# EAGLE design dvere (EAGLE 5.12)
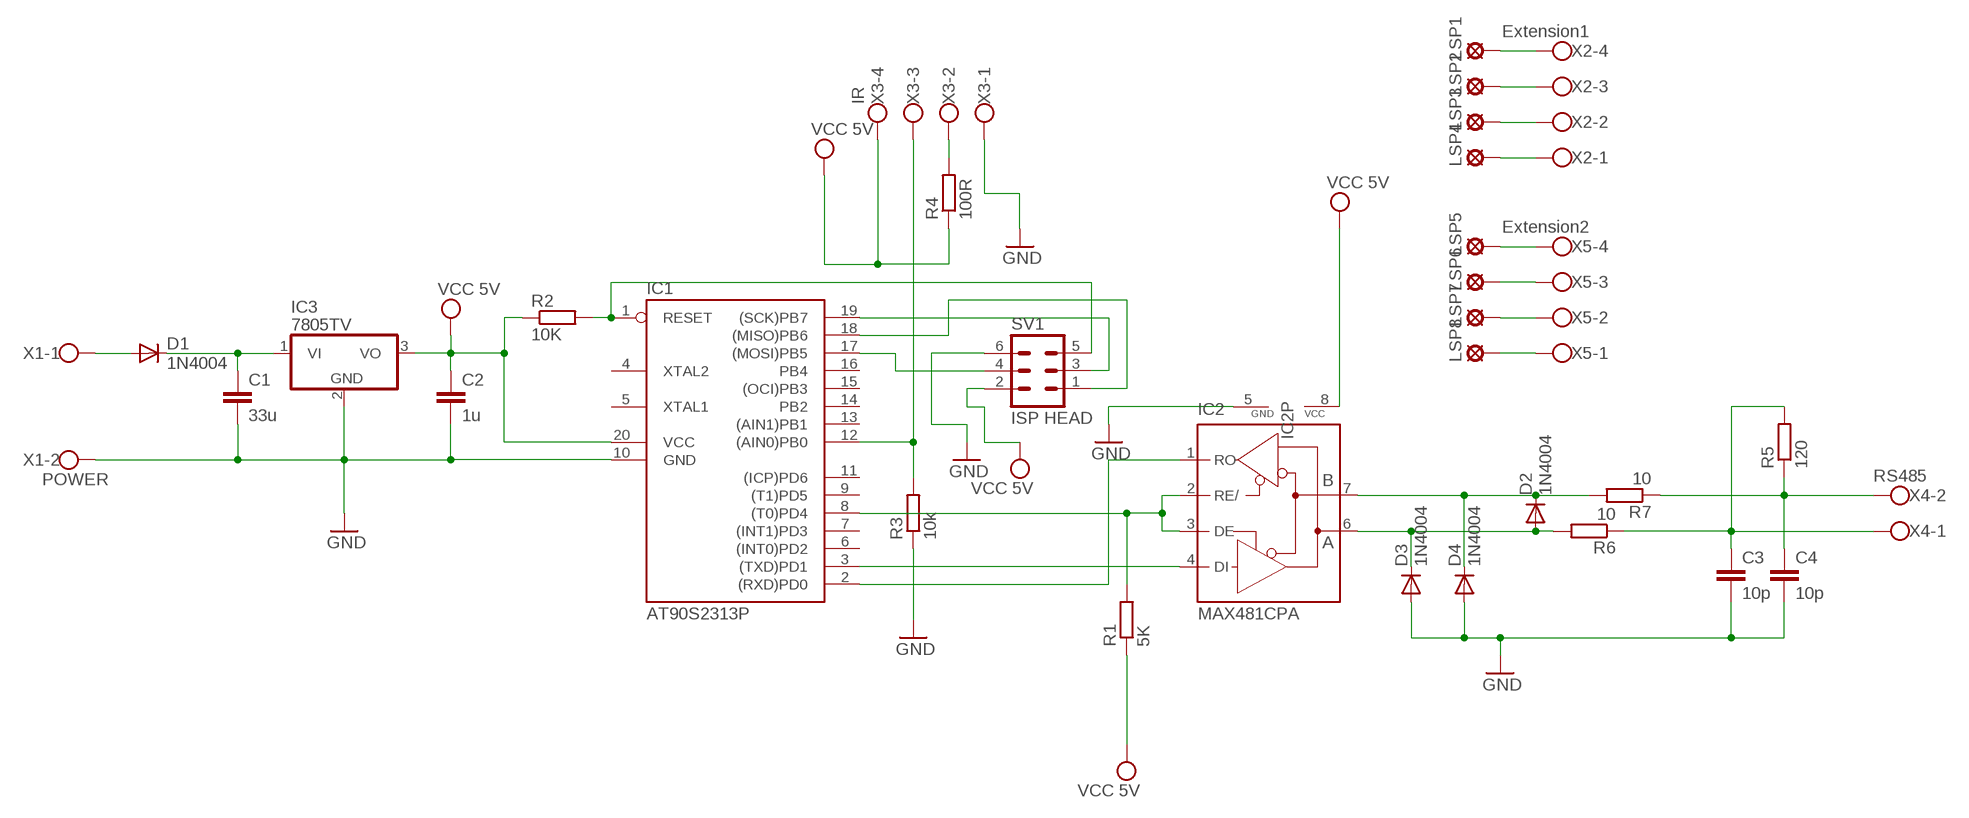
[diagram p0: schematic, sheet 1]

## Parts
C1  33u  C-EU025-025X050  [C025-025X050]
C2  1u  C-EU025-025X050  [C025-025X050]
C3  10p  C-EU025-025X050  [C025-025X050]
C4  10p  C-EU025-025X050  [C025-025X050]
D1  1N4004  [DO41-10]
D2  1N4004  [DO41-10]
D3  1N4004  [DO41-10]
D4  1N4004  [DO41-10]
IC1  AT90S2313P  [DIL20]
IC2  MAX481CPA  [DIL08]
IC3  7805TV  [TO220V]
LSP1  SE11  [SE11]
LSP2  SE11  [SE11]
LSP3  SE11  [SE11]
LSP4  SE11  [SE11]
LSP5  SE11  [SE11]
LSP6  SE11  [SE11]
LSP7  SE11  [SE11]
LSP8  SE11  [SE11]
R1  5K  R-EU_0207/10  [0207/10]
R2  10K  R-EU_0207/10  [0207/10]
R3  10k  R-EU_0207/10  [0207/10]
R4  100R  R-EU_0207/10  [0207/10]
R5  120  R-EU_0207/10  [0207/10]
R6  10  R-EU_0207/10  [0207/10]
R7  10  R-EU_0207/10  [0207/10]
SV1  ISP HEAD  ML6  [ML6]
X1  POWER  W237-102  [W237-102]
X2  Extension1  W237-4  [W237-4]
X3  IR  W237-4  [W237-4]
X4  RS485  W237-102  [W237-102]
X5  Extension2  W237-4  [W237-4]

## Nets
GND: C1.2 C2.2 C3.2 C4.2 D3.A D4.A IC1.10(GND) IC2.5(GND) IC3.2(GND) R3.1 SV1.6 X1.2 X3.1
N$1: IC1.17((MOSI)PB5) SV1.4
N$2: IC1.2((RXD)PD0) IC2.1(RO)
N$3: IC1.3((TXD)PD1) IC2.4(DI)
N$4: IC1.8((T0)PD4) IC2.2(RE/) IC2.3(DE) R1.2
N$5: IC1.19((SCK)PB7) SV1.3
N$6: IC1.18((MISO)PB6) SV1.1
N$7: IC1.1(RESET) R2.2 SV1.5
N$8: D1.A X1.1
N$9: C3.1 R5.2 R6.1 X4.1
N$10: D2.C D4.C IC2.7(B) R7.2
N$11: IC1.12((AIN0)PB0) R3.2 X3.3
N$12: R4.2 X3.2
N$13: C1.1 D1.C IC3.1(VI)
N$14: LSP1.MP X2.4
N$15: LSP2.MP X2.3
N$16: LSP3.MP X2.2
N$17: LSP4.MP X2.1
N$18: LSP5.MP X5.4
N$19: LSP6.MP X5.3
N$20: LSP7.MP X5.2
N$21: LSP8.MP X5.1
N$22: C4.1 R5.1 R7.1 X4.2
N$23: D2.A D3.C IC2.6(A) R6.2
VCC: C2.1 IC1.20(VCC) IC2.8(VCC) IC3.3(VO) R1.1 R2.1 R4.1 SV1.2 X3.4 ; supply symbol labelled VCC 5V
Unconnected: IC1.4(XTAL2) IC1.5(XTAL1) IC1.6((INT0)PD2) IC1.7((INT1)PD3) IC1.9((T1)PD5) IC1.11((ICP)PD6) IC1.13((AIN1)PB1) IC1.14(PB2) IC1.15((OCI)PB3) IC1.16(PB4)

## Library data of the parts
C1-C4 = rcl:C-EU: CAPACITOR, European symbol
D1-D4 = diode:1N4004: DIODE general purpose rectifier, 1 A
IC1 = atmel:AT90S2313: MICROCONTROLLER 2 Kbytes FLASH 128 bytes SRAM 128 bytes EEPROM UART; OC_FARNELL: unknown; OC_NEWARK: unknown
IC2 = maxim:MAX481CPA: RS485 TRANSEIVER; MPN: MAX481CPA+; OC_FARNELL: unknown; OC_NEWARK: 99K3445
IC3 = linear:78*: Positive VOLTAGE REGULATOR Source: http://cache.national.com/ds/LM/LM78L05.pdf http://www.fairchildsemi.com/ds/LM/LM7805.pdf
LSP1-LSP8 = solpad:SE11: SOLDER PAD RTM, drill 1,1mm, distributor Buerklin, 07F810
R1-R7 = rcl:R-EU_: RESISTOR, European symbol
SV1 = con-harting-ml:ML6: HARTING; OC_FARNELL: unknown; OC_NEWARK: unknown
X1 X4 = con-wago-500:W237-102: WAGO SCREW CLAMP; MPN: 237-102; OC_FARNELL: unknown; OC_NEWARK: 70K9898
X2 X3 X5 = con-wago-500:W237-4: WAGO SCREW CLAMP; OC_FARNELL: unknown; OC_NEWARK: unknown

## Board
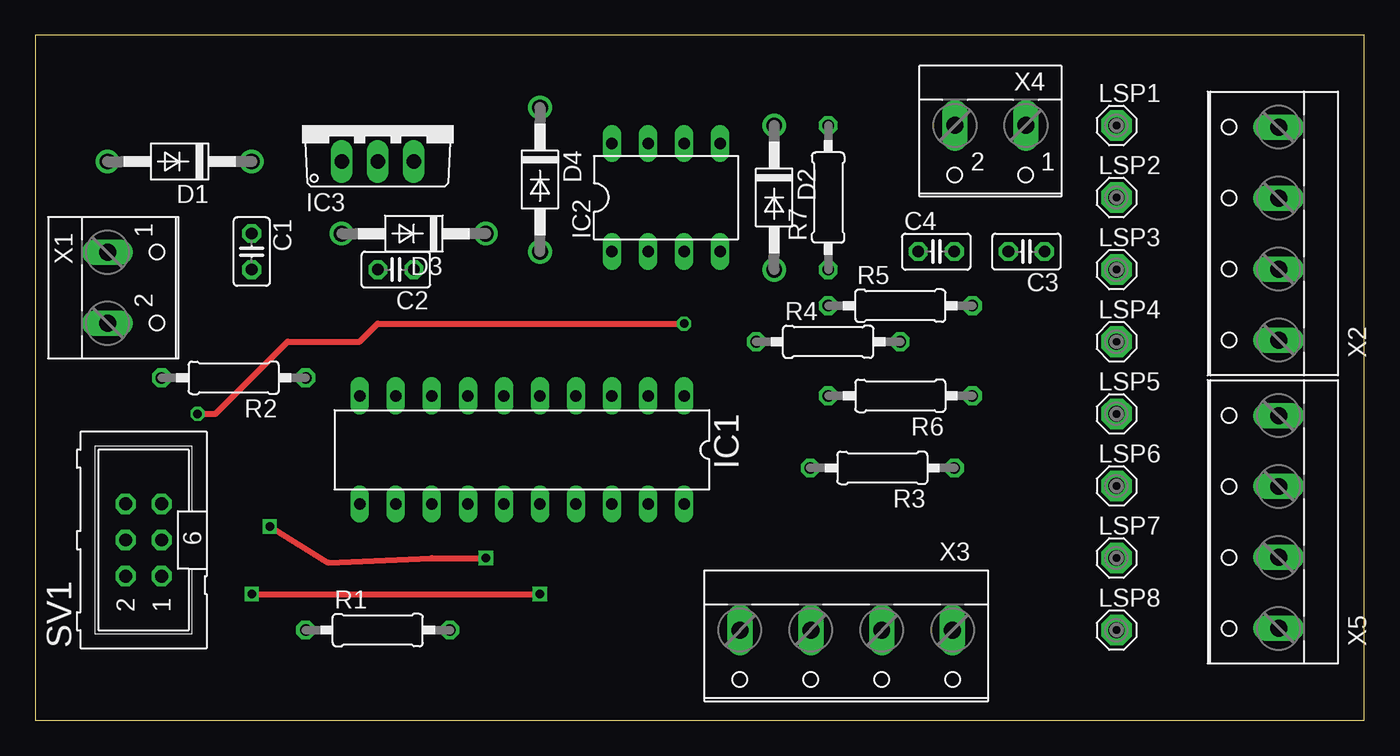
[diagram p1: board, top side]
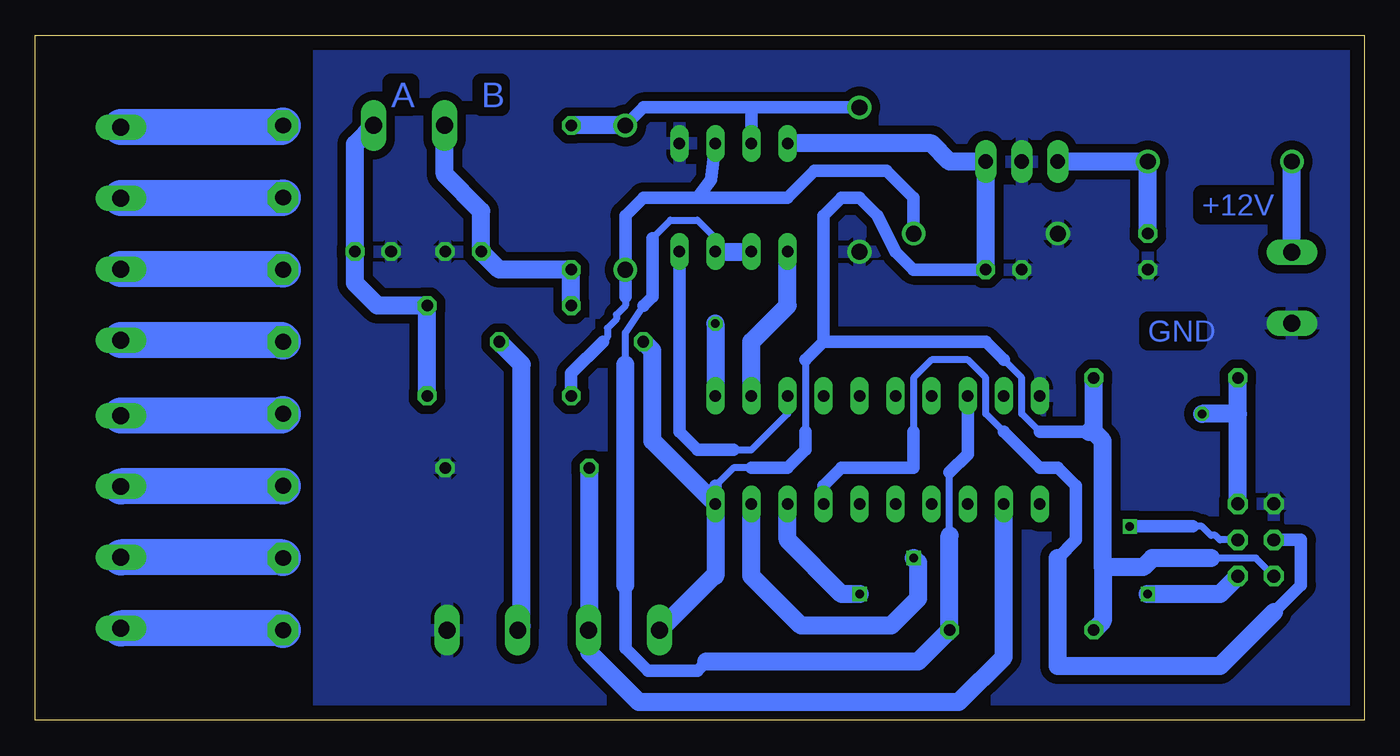
[diagram p2: board, bottom side, seen from below]

Size 93.65 x 48.25 mm. Coordinates in mm from the lower left corner, seen from the top.
Outline: 0,0 93.65,0 93.65,48.25 0,48.25 0,0
Copper layers (1*16): Top 0.035mm / dielectric 1.5mm / Bottom 0.035mm
Design rules "default": minimum track width 10mil, minimum drill 24mil, track to track 8mil, track to pad 8mil, pad to pad 8mil, via to via 8mil, smd to smd 8mil, copper to edge 40mil, drill to drill 8mil, minimum pad ring 10mil, minimum via ring 8mil, stop-mask expansion 4mil, vias tented up to drill 0mil, thermal gap 10mil

### Footprints (pad centres in the part's own frame; a part is rotated, then mirrored left to right if it is on the bottom)
C025-025X050 = drill 0.813 octagon: 1 -1.27,0; 2 1.27,0
DO41-10 = drill 1.118 round: A 5.08,0; C -5.08,0
DIL20 = drill 0.813 long: 1 -11.43,-3.81; 2 -8.89,-3.81; 3 -6.35,-3.81; 4 -3.81,-3.81; 5 -1.27,-3.81; 6 1.27,-3.81; 7 3.81,-3.81; 8 6.35,-3.81; 9 8.89,-3.81; 10 11.43,-3.81; 11 11.43,3.81; 12 8.89,3.81; 13 6.35,3.81; 14 3.81,3.81; 15 1.27,3.81; 16 -1.27,3.81; 17 -3.81,3.81; 18 -6.35,3.81; 19 -8.89,3.81; 20 -11.43,3.81
DIL08 = drill 0.813 long: 1 -3.81,-3.81; 2 -1.27,-3.81; 3 1.27,-3.81; 4 3.81,-3.81; 5 3.81,3.81; 6 1.27,3.81; 7 -1.27,3.81; 8 -3.81,3.81
TO220V = drill 1.016 long: 1 -2.54,-2.54; 2 0,-2.54; 3 2.54,-2.54
SE11 = drill 1.118 pad 2.159 octagon: MP 0,0
0207/10 = drill 0.813 octagon: 1 -5.08,0; 2 5.08,0
ML6 = drill 0.914 octagon: 1 -2.54,-1.27; 2 -2.54,1.27; 3 0,-1.27; 4 0,1.27; 5 2.54,-1.27; 6 2.54,1.27
W237-102 = drill 1.194 long: 1 -2.5,-1.27; 2 2.5,-1.27
W237-4 = drill 1.194 long: 1 -7.5,-1.27; 2 -2.5,-1.27; 3 2.5,-1.27; 4 7.5,-1.27

### Placement (x,y rotation side)
C1  15.24,33.02 270 top
C2  25.4,31.75 180 top
C3  69.85,33.02 180 top
C4  63.5,33.02 0 top
D1  10.16,39.37 180 top
D2  52.07,36.83 270 top
D3  26.67,34.29 180 top
D4  35.56,38.1 270 top
IC1  34.29,19.05 180 top
IC2  44.45,36.83 0 top
IC3  24.13,41.91 0 top
LSP1  76.2,41.91 0 top
LSP2  76.2,36.83 0 top
LSP3  76.2,31.75 0 top
LSP4  76.2,26.67 0 top
LSP5  76.2,21.59 0 top
LSP6  76.2,16.51 0 top
LSP7  76.2,11.43 0 top
LSP8  76.2,6.35 0 top
R1  24.13,6.35 0 top
R2  13.97,24.13 180 top
R3  59.69,17.78 180 top
R4  55.88,26.67 0 top
R5  60.96,29.21 0 top
R6  60.96,22.86 180 top
R7  55.88,36.83 90 top
SV1  7.62,12.7 90 top
X1  6.35,30.48 270 top
X2  86.36,34.29 90 top
X3  57.15,5.08 180 top
X4  67.31,40.64 180 top
X5  86.36,13.97 90 top

### Tracks (layer width: path | path; a pad name or v marks a point on that pad's centre or on a via)
GND
  pour Bottom (isolate 0.61): 1.27,0 0,0 0,48.26 73.66,48.26 73.66,0
N$1
  Bottom 0.508: 31.75,20.32 31.75,24.13 30.48,25.4 27.94,25.4 26.67,24.13 26.67,21.59 25.4,20.32
  Bottom 0.889: IC1.17 38.1,16.51 36.83,17.78 31.75,17.78 31.75,20.32 | 25.4,20.32 22.86,17.78 21.59,17.78 20.32,16.51 20.32,12.7 21.59,11.43 | 6.35,7.62 4.45,9.53 4.45,12.7 SV1.4
  Bottom 1.27: 21.59,11.43 21.59,3.81 10.16,3.81 6.35,7.62
N$2
  Bottom 1.27: IC1.2 43.18,26.67 40.64,29.21 IC2.1
N$3
  Bottom 0.508: IC1.3 40.64,21.59 43.18,19.05 44.45,19.05
  Bottom 0.889: 44.45,19.05 46.99,19.05 48.26,20.32 IC2.4
N$4
  Bottom 0.508: IC2.3 45.72,33.97 46.99,35.24 48.9,35.24 50.16,33.97 | 52.07,25.08 52.07,27.3 50.8,29.21 | 29.21,13.02 29.21,17.46
  Bottom 0.889: 52.07,9.53 52.07,5.08 50.48,3.49 46.99,3.49 46.35,4.13 | IC1.8 27.94,18.73 29.21,17.46 | 50.8,29.21 50.16,29.84 50.16,33.97
  Bottom 1.27: IC2.3 IC2.2 | 52.07,9.53 52.07,25.08 | 46.35,4.13 31.43,4.13 R1.2 29.21,13.02
N$5  (via drill 0.6)
  Top 0.406: v31.75,11.43 27.94,11.43 20.64,11.11 v16.51,13.65
  Bottom 0.508: SV1.3 10.16,12.7 10.48,13.02 10.79,13.02 11.43,13.65 12.06,13.65
  Bottom 0.889: 12.06,13.65 v16.51,13.65
  Bottom 1.27: IC1.19 43.18,10.16 39.69,6.67 33.34,6.67 31.43,8.57 31.43,11.11 v31.75,11.43
N$6  (via drill 0.6)
  Top 0.406: v15.24,8.89 v35.56,8.89
  Bottom 1.27: IC1.18 40.64,12.7 36.83,8.89 v35.56,8.89 | SV1.1 10.16,8.89 v15.24,8.89
N$7  (via drill 0.6)
  Top 0.406: v11.43,21.59 12.7,21.59 17.78,26.67 22.86,26.67 24.13,27.94 v45.72,27.94
  Bottom 1.27: v45.72,27.94 IC1.1 | SV1.5 8.89,21.59 | 8.89,21.59 R2.2 | 8.89,21.59 v11.43,21.59
N$8
  Bottom 1.27: X1.1 D1.A
N$9
  Bottom 1.27: X4.1 71.12,40.6 C3.1 71.12,30.8 69.53,29.21 R5.2 R6.1
N$10
  Bottom 0.889: 43.18,43.18 IC2.7 | D2.C 50.8,43.18 43.18,43.18 | D4.C 43.18,43.18
  Bottom 1.27: D2.C R7.2
N$11
  Bottom 0.254: 54.61,6.35 X3.3
  Bottom 0.889: 54.61,6.03 54.61,6.35
  Bottom 1.27: 54.61,6.35 R3.2 | 54.61,6.03 54.61,4.76 51.12,1.27 28.57,1.27 25.4,4.45 IC1.12
N$12
  Bottom 1.27: R4.2 59.37,25.08 59.37,6.63 X3.2
N$13
  Bottom 1.27: IC3.1 D1.C C1.1
N$14
  Bottom 2.54: LSP1.MP 76.32,41.79 X2.4
N$15
  Bottom 2.54: LSP2.MP 76.24,36.79 X2.3
N$16
  Bottom 2.54: LSP3.MP 76.24,31.79 X2.2
N$17
  Bottom 2.54: LSP4.MP 76.32,26.79 X2.1
N$18
  Bottom 2.54: LSP5.MP 76.32,21.47 X5.4
N$19
  Bottom 2.54: LSP6.MP 76.24,16.47 X5.3
N$20
  Bottom 2.54: LSP7.MP 76.24,11.47 X5.2
N$21
  Bottom 2.54: LSP8.MP 76.32,6.47 X5.1
N$22
  Bottom 1.27: R5.1 R7.1 60.96,31.75 C4.1 62.23,35.88 64.81,38.46 X4.2
N$23
  Bottom 0.254: D2.A 52.07,33.02
  Bottom 0.508: 52.07,29.84 52.07,29.21 52.7,28.57 52.7,28.26 53.34,27.62 53.34,26.99 53.66,26.67
  Bottom 0.889: D3.C 31.75,36.83 33.66,38.73 38.73,38.73 40.64,36.83 46.99,36.83 | IC2.6 46.04,38.1 46.99,36.83 | 46.99,36.83 50.8,36.83 52.07,35.56 D2.A 52.07,29.84 | 53.66,26.67 55.88,24.45 R6.2
N$24  (via drill 0.6)
  other vias: 15.24,8.89
N$25  (via drill 0.6)
  other vias: 35.56,8.89
N$26  (via drill 0.6)
  other vias: 16.51,13.65
N$27  (via drill 0.6)
  other vias: 31.75,11.43
N$28  (via drill 0.6)
  other vias: 11.43,21.59
VCC
  Bottom 0.254: X3.4 49.53,6.35
  Bottom 0.508: 39.37,25.4 39.37,20.32 | 45.72,16.51 44.45,17.78 43.18,17.78 | 25.4,25.4 24.13,24.13 24.13,21.59 22.86,20.32 | SV1.2 7.62,11.43 10.79,11.43
  Bottom 0.889: C2.1 31.75,31.75 33.02,33.02 34.29,35.56 35.56,36.83 36.83,36.83 38.1,35.56 38.1,26.67 | 45.72,16.51 IC1.20 | 39.37,20.32 39.37,19.05 40.64,17.78 43.18,17.78 | 38.1,26.67 39.37,25.4 | 38.1,26.67 26.67,26.67 25.4,25.4 | 19.05,20.32 19.37,20.32 22.86,20.32
  Bottom 1.27: IC2.8 30.48,40.64 29.21,39.37 IC3.3 C2.1 | X3.4 45.84,10.16 45.72,10.16 IC1.20 50.16,19.68 50.16,26.04 R4.1 | R1.1 18.41,6.99 18.41,10.8 | 18.41,10.8 18.41,19.68 19.05,20.32 | R2.1 19.05,20.64 19.37,20.32 | 10.79,11.43 14.92,11.43 15.56,10.8 18.41,10.8

### Text on the board
Bottom: B | A | +12V | GND